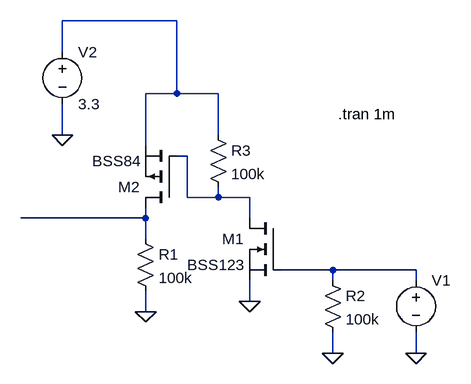
[diagram p0: schematic NFC_PWR.asc]
NFC_PWR.asc, the LTspice schematic file:
Version 4
SHEET 1 880 680
WIRE 64 -208 -112 -208
WIRE -112 -160 -112 -208
WIRE 64 -96 64 -208
WIRE 64 -96 16 -96
WIRE 128 -96 64 -96
WIRE -112 -32 -112 -80
WIRE 128 -32 128 -96
WIRE 16 -16 16 -96
WIRE 80 0 64 0
WIRE 80 64 80 0
WIRE 128 64 128 48
WIRE 128 64 80 64
WIRE 176 64 128 64
WIRE 16 96 16 80
WIRE 16 96 -176 96
WIRE 176 96 176 64
WIRE 16 128 16 96
WIRE 304 176 224 176
WIRE 432 176 304 176
WIRE 304 192 304 176
WIRE 432 192 432 176
WIRE 176 224 176 192
WIRE 16 240 16 208
WIRE 304 304 304 272
WIRE 432 304 432 272
FLAG 176 224 0
FLAG 16 240 0
FLAG 304 304 0
FLAG 432 304 0
FLAG -112 -32 0
SYMBOL nmos 224 96 M0
SYMATTR InstName M1
SYMATTR Value BSS123
SYMBOL pmos 64 80 R180
SYMATTR InstName M2
SYMATTR Value BSS84
SYMBOL res 0 112 R0
SYMATTR InstName R1
SYMATTR Value 100k
SYMBOL res 288 176 R0
SYMATTR InstName R2
SYMATTR Value 100k
SYMBOL voltage 432 176 R0
WINDOW 3 24 96 Invisible 2
WINDOW 123 0 0 Left 0
WINDOW 39 0 0 Left 0
SYMATTR InstName V1
SYMATTR Value PULSE(0 3.3 100u 1n 1n 200u 400u)
SYMBOL res 112 -48 R0
SYMATTR InstName R3
SYMATTR Value 100k
SYMBOL voltage -112 -176 R0
WINDOW 123 0 0 Left 0
WINDOW 39 0 0 Left 0
SYMATTR InstName V2
SYMATTR Value 3.3
TEXT 312 -64 Left 2 !.tran 1m

The netlist it stands for:
* NFC_PWR.asc
M1 N002 N004 0 0 BSS123
M2 N003 N002 N001 N001 BSS84
R1 N003 0 100k
R2 N004 0 100k
V1 N004 0 PULSE(0 3.3 100u 1n 1n 200u 400u)
R3 N001 N002 100k
V2 N001 0 3.3
.model NMOS NMOS
.model PMOS PMOS
.lib standard.mos
.tran 1m
.backanno
.end